# Altium schematic sheet RGB_LEDs.SchDoc: Smartknob RGB LEDs
size A3; DrawnBy: Mani Magnusson; Revision: 1; SheetNumber: 6; SheetTotal: 6
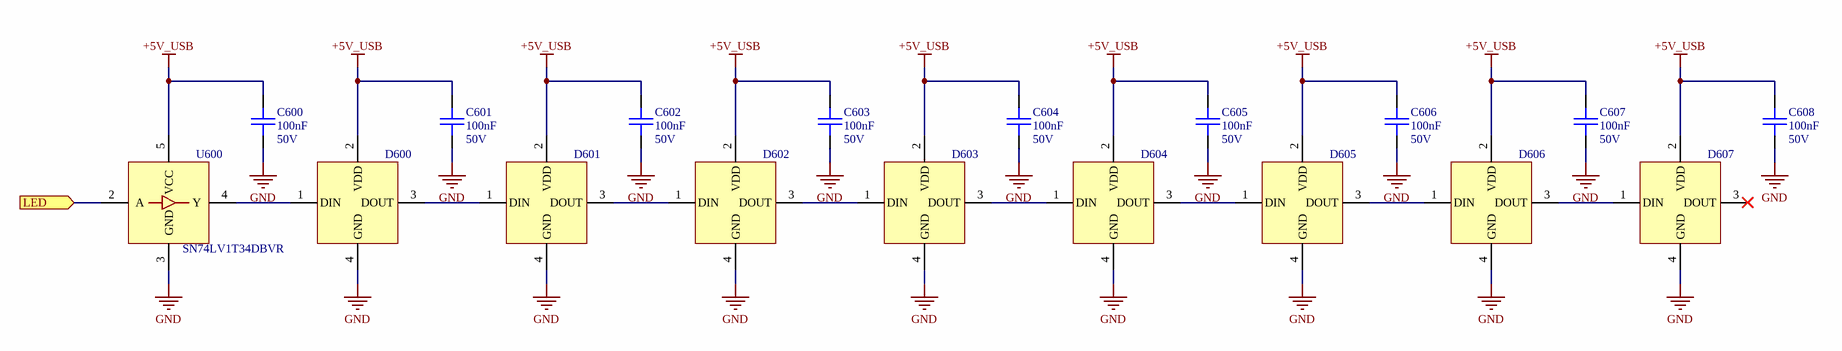
[diagram p0: RGB_LEDs.SchDoc]

## Parts
C600  value 100nF  Voltage: 50V  [C0603]  (hidden comment: CAP)
C601  value 100nF  Voltage: 50V  [C0603]  (hidden comment: CAP)
C602  value 100nF  Voltage: 50V  [C0603]  (hidden comment: CAP)
C603  value 100nF  Voltage: 50V  [C0603]  (hidden comment: CAP)
C604  value 100nF  Voltage: 50V  [C0603]  (hidden comment: CAP)
C605  value 100nF  Voltage: 50V  [C0603]  (hidden comment: CAP)
C606  value 100nF  Voltage: 50V  [C0603]  (hidden comment: CAP)
C607  value 100nF  Voltage: 50V  [C0603]  (hidden comment: CAP)
C608  value 100nF  Voltage: 50V  [C0603]  (hidden comment: CAP)
D600  LED_NEOPIXEL  [SK6812B_SIDE]  (value not drawn)
D601  LED_NEOPIXEL  [SK6812B_SIDE]  (value not drawn)
D602  LED_NEOPIXEL  [SK6812B_SIDE]  (value not drawn)
D603  LED_NEOPIXEL  [SK6812B_SIDE]  (value not drawn)
D604  LED_NEOPIXEL  [SK6812B_SIDE]  (value not drawn)
D605  LED_NEOPIXEL  [SK6812B_SIDE]  (value not drawn)
D606  LED_NEOPIXEL  [SK6812B_SIDE]  (value not drawn)
D607  LED_NEOPIXEL  [SK6812B_SIDE]  (value not drawn)
U600  Manufacturer Part No: SN74LV1T34DBVR  [SOT-25-5]  (hidden comment: SN74LV1T34)

## Ports
LED (in)

## Nets
+5V_USB: C600.1 C601.1 C602.1 C603.1 C604.1 C605.1 C606.1 C607.1 C608.1 D600.2(VDD) D601.2(VDD) D602.2(VDD) D603.2(VDD) D604.2(VDD) D605.2(VDD) D606.2(VDD) D607.2(VDD) U600.5(VCC)
GND: C600.2 C601.2 C602.2 C603.2 C604.2 C605.2 C606.2 C607.2 C608.2 D600.4(GND) D601.4(GND) D602.4(GND) D603.4(GND) D604.4(GND) D605.4(GND) D606.4(GND) D607.4(GND) U600.3(GND)
LED: U600.2(A) ; port LED
NetD600_1: D600.1(DIN) U600.4(Y)
NetD600_3: D600.3(DOUT) D601.1(DIN)
NetD601_3: D601.3(DOUT) D602.1(DIN)
NetD602_3: D602.3(DOUT) D603.1(DIN)
NetD603_3: D603.3(DOUT) D604.1(DIN)
NetD604_3: D604.3(DOUT) D605.1(DIN)
NetD605_3: D605.3(DOUT) D606.1(DIN)
NetD606_3: D606.3(DOUT) D607.1(DIN)

Not connected (* = marked no-connect by the designer): D607 3(DOUT)*

## Notes on the sheet
- Sheet title:
- Revision:
- Drawn by:
- Date:
- File:

## Library data of the parts
C600-C608 = CGA3E2X7R1H104K080AA: General purpose ceramic capacitor; Manufacturer: TDK Corporation; Specification: X7R, 50V, AEC-Q200 Qualified; Ready for use: y; Fitted: Fitted; Package Ref: C0603; Part Reference: CGA3E2X7R1H104K080AA; Manufacturer Part No: CGA3E2X7R1H104K080AA; Supplier: Digi-Key; Supplier Part No: 445-5666-1-ND; Generic: Generic
D600-D607 = 4691: Side mounted RGB neopixel; Part Reference: 4691; Manufacturer: Adafruit; Generic: Non Generic; Ready for use: y; Fitted: Fitted; Package Ref: SK6812B_SIDE; Manufacturer Part No: 4691; Supplier: Digi-Key; Supplier Part No: 1528-4691-ND; Value: RGB
U600 = SN74LV1T34DBVR: Single Buffer CMOS Level Shifter; Manufacturer: Texas Instruments; Ready for use: y; Fitted: Fitted; Package Ref: SOT-25-5; Part Reference: SN74LV1T34DBVR; Supplier: Digi-Key; Supplier Part No: 296-37176-1-ND; Generic: Generic; Type: Logic